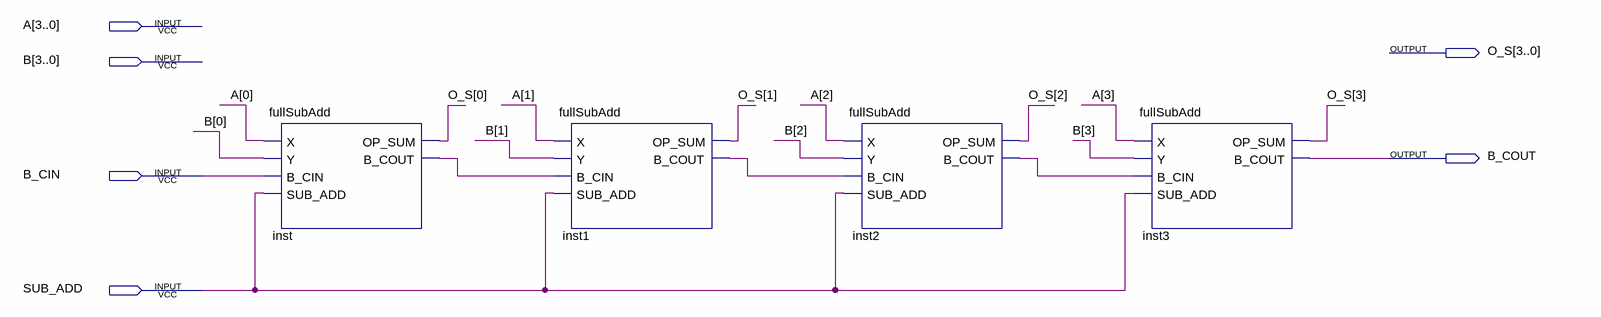
[diagram p0: schematic sheet]
// Quartus schematic four_bit_sub_add.bdf as structural Verilog: 4 symbols, 6 pins
module four_bit_sub_add (
  input  [3:0] A,
  input  [3:0] B,
  input  B_CIN,
  input  SUB_ADD,
  output [3:0] O_S,
  output B_COUT
);

  wire inst1_b_cout, inst2_b_cout, inst_b_cout;

  fullSubAdd inst (.X(A[0]), .Y(B[0]), .B_CIN(B_CIN), .SUB_ADD(SUB_ADD), .OP_SUM(O_S[0]), .B_COUT(inst_b_cout));
  fullSubAdd inst1 (.X(A[1]), .Y(B[1]), .B_CIN(inst_b_cout), .SUB_ADD(SUB_ADD), .OP_SUM(O_S[1]), .B_COUT(inst1_b_cout));
  fullSubAdd inst2 (
    .X(A[2]), .Y(B[2]), .B_CIN(inst1_b_cout), .SUB_ADD(SUB_ADD), .OP_SUM(O_S[2]), .B_COUT(inst2_b_cout));
  fullSubAdd inst3 (.X(A[3]), .Y(B[3]), .B_CIN(inst2_b_cout), .SUB_ADD(SUB_ADD), .OP_SUM(O_S[3]), .B_COUT(B_COUT));
endmodule
